# Altium schematic sheet obc_spi_to_i2c.SchDoc: SPI to I2C Bridge
size A4; DrawnBy: Mohamed Hirole; Organization: UTAT SS; DocumentNumber: 4; Revision: 1.0; SheetNumber: 4; SheetTotal: 8
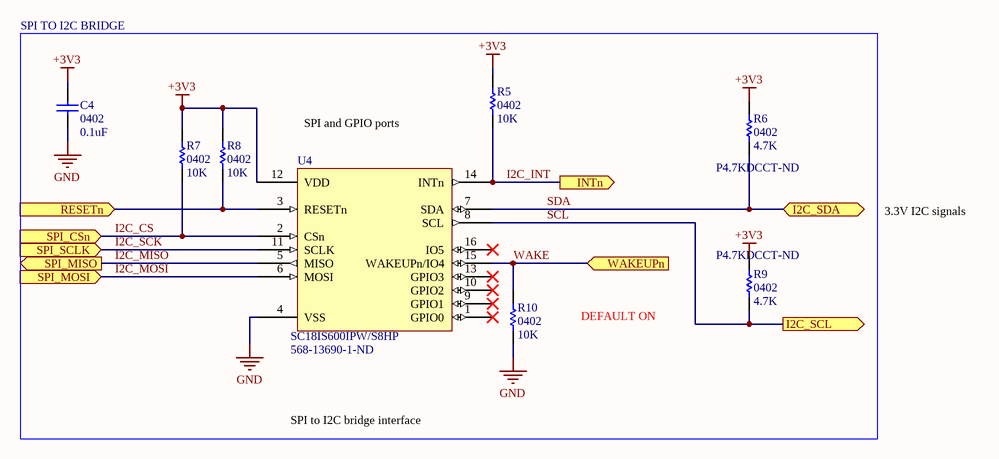
[diagram p0: obc_spi_to_i2c.SchDoc]

## Parts
C4  0402  value 0.1uF  [CAP0402R]
R5  0402  value 10K  [RES0402R]
R6  0402  value 4.7K  Supplier Part Number 1: P4.7KDCCT-ND  [RES0402R]
R7  0402  value 10K  [RES0402R]
R8  0402  value 10K  [RES0402R]
R9  0402  value 4.7K  Supplier Part Number 1: P4.7KDCCT-ND  [RES0402R]
R10  0402  value 10K  [RES0402R]
U4  SC18IS600IPW/S8HP  Supplier Part Number 1: 568-13690-1-ND  [TSOP65P640X110-16N]

## Ports
I2C_SCL (out), I2C_SDA (bidir), INTn (out), RESETn (in), SPI_CSn (in), SPI_MISO (out), SPI_MOSI (in), SPI_SCLK (in), WAKEUPn (in)

## Nets
+3V3: C4.2 R5.2 R6.2 R7.2 R8.2 R9.2 U4.12(VDD)
GND: C4.1 R10.1 U4.4(VSS)
I2C_CS: R7.1 U4.2(CSn) ; port SPI_CSn
I2C_INT: R5.1 U4.14(INTn) ; port INTn
I2C_MISO: U4.5(MISO) ; port SPI_MISO
I2C_MOSI: U4.6(MOSI) ; port SPI_MOSI
I2C_SCK: U4.11(SCLK) ; port SPI_SCLK
RESETn: R8.1 U4.3(RESETn) ; port RESETn
SCL: R9.1 U4.8(SCL) ; port I2C_SCL
SDA: R6.1 U4.7(SDA) ; port I2C_SDA
WAKE: R10.2 U4.15(WAKEUPn/IO4) ; port WAKEUPn

Not connected (* = marked no-connect by the designer): U4 1(GPIO0)* 9(GPIO1)* 10(GPIO2)* 13(GPIO3)* 16(IO5)*

## Notes on the sheet
- SPI TO I2C BRIDGE
- SPI and GPIO ports
- 3.3V I2C signals
- DEFAULT ON
- SPI to I2C bridge interface

## Library data of the parts
C4 = CAP0402: 0402 capacitor
R5 R7 R8 R10 = RES0402: 0402 resistor
R6 R9 = RES0402: 0402 resistor; Manufacturer: Panasonic; Manufacturer Part Number: ERA-2AEB472X; Description: METAL FILM RESISTOR, 4.7KOHM, 63mW,  0.1%; Product Range:AEC-Q200 ERA Series; Resistance:4.7kohm; Power Rating:63mW; Resistance Tolerance:  0.1%; Voltage Rating:25V; Resistor Case Style:0402 ^1005 Metric]; Packaging:Cut Tape; MSL:-; Resistance: 4.7kR; Power Rating: 63mW; Tolerance: 0.1%; Voltage Rating: 25V; Temperature Coefficient: 25ppm/°C; Supplier 1: Digi-Key; Stock 1: 199808; Pricing 1: 1=0.45, 10=0.321, 100=0.1283, 1000=0.06322, 2500=0.05858, 5000=0.053 (USD); Mount: Surface Mount; Case/Package: 0402; Number of Pins: 2; Case Code (Metric): 1005; Case Code (Imperial): 0402; Contact Plating: Tin; Min Operating Temperature: -55°C; Max Operating Temperature: 155°C; Packaging: Tape and Reel; Package Quantity: 1; Composition: Thin Film,Metal Film; Number of Terminations: 2; Military Standard: Not; Max Power Dissipation: 63mW; Voltage Rating (DC): 25V; Termination: SMD/SMT; Length: 1mm; Height: 0.35mm; Width: 0.02inch; Depth: 0.5mm; Radiation Hardening: No; REACH SVHC: No SVHC; Lead Free: Lead Free; ComponentLink1URL: http://www.farnell.com/datasheets/328837.pdf?src-supplier=Farnell; ComponentLink1Description: http://www.farnell.com/datasheets/328837.pdf?src-supplier=Farnell; ComponentLink2URL: http://www.mouser.com/ds/2/315/AOA0000C237-1100991.pdf?src-supplier=Mouser; ComponentLink2Description: http://www.mouser.com/ds/2/315/AOA0000C237-1100991.pdf?src-supplier=Mouser; ComponentLink3URL: http://www.farnell.com/datasheets/328837.pdf?src-supplier=Element14; ComponentLink3Description: http://www.farnell.com/datasheets/328837.pdf?src-supplier=Element14; ComponentLink4URL: http://www.farnell.com/datasheets/1776116.pdf?src-supplier=Element14; ComponentLink4Description: http://www.farnell.com/datasheets/1776116.pdf?src-supplier=Element14; ComponentLink5URL: http://industrial.panasonic.com/www-data/pdf/AOA0000/AOA0000CE26.pdf?src-supplier=Avnet; ComponentLink5Description: http://industrial.panasonic.com/www-data/pdf/AOA0000/AOA0000CE26.pdf?src-supplier=Avnet; ComponentLink6URL: https://www.alliedelec.com/m/d/b6b0537e86f421aa7f5975bb1d8f429a.pdf?src-supplier=Allied+Electronics; ComponentLink6Description: https://www.alliedelec.com/m/d/b6b0537e86f421aa7f5975bb1d8f429a.pdf?src-supplier=Allied+Electronics; ComponentLink7URL: http://uk.rs-online.com/webdocs/0bee/0900766b80beefcc.pdf?src-supplier=RSComponents; ComponentLink7Description: http://uk.rs-online.com/webdocs/0bee/0900766b80beefcc.pdf?src-supplier=RSComponents; ComponentLink8URL: http://industrial.panasonic.com/www-data/pdf/AOA0000/AOA0000CE26.pdf?src-supplier=Future+Electronics; ComponentLink8Description: http://industrial.panasonic.com/www-data/pdf/AOA0000/AOA0000CE26.pdf?src-supplier=Future+Electronics; ComponentLink9URL: http://www.farnell.com/datasheets/1776116.pdf?src-supplier=Farnell; ComponentLink9Description: http://www.farnell.com/datasheets/1776116.pdf?src-supplier=Farnell
U4 = SC18IS600IPW/S8HP: SPI to I2C bridge.; Supplier 1: Digikey